# Altium schematic sheet External Connections.SchDoc
size A
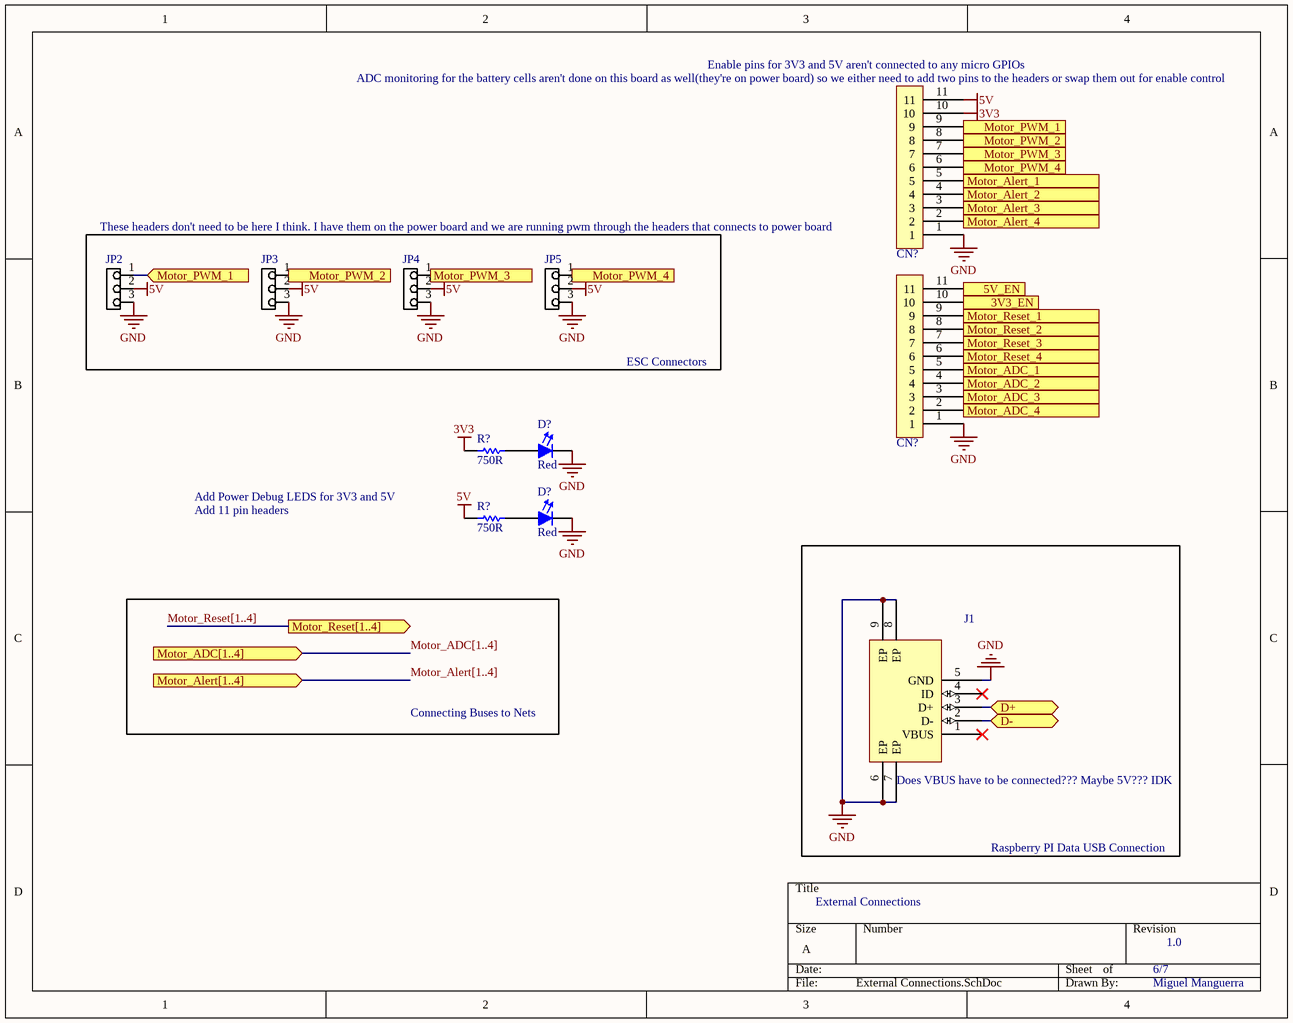
[diagram p0: External Connections.SchDoc]

## Parts
(Parts that share a designator on the sheet are numbered #1, #2 ... from top to bottom, then left to right.)
CN?#1  PH1-11-UA  [PH1-11-UA-Footprint-1]  (value not drawn)
CN?#2  PH1-11-UA  [PH1-11-UA-Footprint-1]  (value not drawn)
D?#1  Color: Red  [FP-LB_Q39E-MFG]  (hidden comment: LSQ976-NR-1)
D?#2  Color: Red  [FP-LB_Q39E-MFG]  (hidden comment: LSQ976-NR-1)
J1  USB - Micro B Female SMD  [Edge Connector]  (value not drawn)
JP2  1x3 Male Jumper  [Header, Male, 1x3, Pitch: 0.1" (2.54mm),THT]  (value not drawn)
JP3  1x3 Male Jumper  [Header, Male, 1x3, Pitch: 0.1" (2.54mm),THT]  (value not drawn)
JP4  1x3 Male Jumper  [Header, Male, 1x3, Pitch: 0.1" (2.54mm),THT]  (value not drawn)
JP5  1x3 Male Jumper  [Header, Male, 1x3, Pitch: 0.1" (2.54mm),THT]  (value not drawn)
R?#1  Resistance: 750R  [RESC0603(1608)_N]  (hidden comment: RC0603FR-07750RL)
R?#2  Resistance: 750R  [RESC0603(1608)_N]  (hidden comment: RC0603FR-07750RL)

## Blocks framed on the sheet
ESC Connectors: JP2-JP5

## Ports
3V3_EN (in), 5V_EN (in), D+ (bidir), D- (bidir), Motor_ADC[1..4] (in), Motor_ADC_1, Motor_ADC_2, Motor_ADC_3, Motor_ADC_4, Motor_Alert[1..4] (in), Motor_Alert_1 (out), Motor_Alert_2 (out), Motor_Alert_3 (out), Motor_Alert_4 (out), Motor_PWM_1 (in), Motor_PWM_2 (in), Motor_PWM_3 (in), Motor_PWM_4 (in), Motor_Reset[1..4] (out), Motor_Reset_1, Motor_Reset_2, Motor_Reset_3, Motor_Reset_4

## Nets
3V3: CN?#1.10 R?#1.2
5V: CN?#1.11 JP2.2 JP3.2 JP4.2 JP5.2 R?#2.2
GND: CN?#1.1 CN?#2.1 D?#1.1(Cathode) D?#2.1(Cathode) J1.5(GND) J1.6(EP) J1.7(EP) J1.8(EP) J1.9(EP) JP2.3 JP3.3 JP4.3 JP5.3
3V3_EN: CN?#2.10 ; port 3V3_EN
5V_EN: CN?#2.11 ; port 5V_EN
D+: J1.3(D+) ; port D+
D-: J1.2(D-) ; port D-
Motor_ADC_1: CN?#2.5 ; port Motor_ADC_1
Motor_ADC_2: CN?#2.4 ; port Motor_ADC_2
Motor_ADC_3: CN?#2.3 ; port Motor_ADC_3
Motor_ADC_4: CN?#2.2 ; port Motor_ADC_4
Motor_Alert_1: CN?#1.5 ; port Motor_Alert_1
Motor_Alert_2: CN?#1.4 ; port Motor_Alert_2
Motor_Alert_3: CN?#1.3 ; port Motor_Alert_3
Motor_Alert_4: CN?#1.2 ; port Motor_Alert_4
Motor_PWM_1: CN?#1.9 JP2.1 ; port Motor_PWM_1
Motor_PWM_2: CN?#1.8 JP3.1 ; port Motor_PWM_2
Motor_PWM_3: CN?#1.7 JP4.1 ; port Motor_PWM_3
Motor_PWM_4: CN?#1.6 JP5.1 ; port Motor_PWM_4
Motor_Reset_1: CN?#2.9 ; port Motor_Reset_1
Motor_Reset_2: CN?#2.8 ; port Motor_Reset_2
Motor_Reset_3: CN?#2.7 ; port Motor_Reset_3
Motor_Reset_4: CN?#2.6 ; port Motor_Reset_4
NetD?#1_2: D?#1.2(Anode) R?#1.1
NetD?#2_2: D?#2.2(Anode) R?#2.1

Not connected (* = marked no-connect by the designer): J1 1(VBUS)* 4(ID)*

## Buses and harness runs
bus Motor_ADC[1..4] = port Motor_ADC[1..4]
bus Motor_Alert[1..4] = port Motor_Alert[1..4]
bus Motor_Reset[1..4] = port Motor_Reset[1..4]

## Notes on the sheet
- (near CN?#1) ADC monitoring for the battery cells aren't done on this board as well(they're on power board) so we either need to add two pins to the headers or swap them out for enable control
- (near CN?#1) Enable pins for 3V3 and 5V aren't connected to any micro GPIOs
- (near CN?#1) These headers don't need to be here I think. I have them on the power board and we are running pwm through the headers that connects to power board
- Add Power Debug LEDS for 3V3 and 5V
- Add 11 pin headers
- Connecting Buses to Nets
- (near J1) Does VBUS have to be connected??? Maybe 5V??? IDK
- External Connections
- Raspberry PI Data USB Connection
- 6/7
- 1.0
- Miguel Manguerra

## Library data of the parts
CN?#1 CN?#2 = CMP-00135-1: Connector Header Through Hole 11 position 0.100" (2.54mm)
D?#1 D?#2 = CMP-00066-2: LED Red 645nm 2-Pin Chip 0603(1608Metric) T/R; Lens Transparency: Diffused; Power Dissipation: 65mW; Forward Voltage: 2.5V; Dominant Wavelength: 633nm; Number of Elements: 1; Lens Style: Diffused,Flat,Colorless,Rectangular; Lens Color: White; Viewing Angle: 160°; Luminous Flux: 0.33lm; Test Current: 20mA; Forward Current: 25mA; Luminous Intensity: 180mcd; Reverse Voltage: 12V; Lens Size: 0.8mm; Max Operating Temperature: 85°C; Depth: 0.9mm; Illumination Color: Red; Packaging: Tape and Reel; Min Operating Temperature: -30°C; Case Code (Imperial): 0603; Case Code (Metric): 1608; Number of Pins: 2; Mount: Surface Mount; Height: 0.8mm; Package Quantity: 1; Length: 1.7mm; Width: 0.8mm; Number of LEDs: 1; Case/Package: 0603; Radiation Hardening: No
J1 = CMP-00108-2: USB - Micro B Female USB 2 5 SMD USB Connectors; Created by: Miguel Manguerra; LCSC Part Number: C319170
JP2-JP5 = CMP-004-0002-1: Made By: Poorna Chander Kalidas; Component Type: Standard; Design Item ID: 1x3 Male Jumper; Source: AUVic_Schematic_Library_Connectors.SchLib; Pin Count: 3
R?#1 R?#2 = CMP-00070-1: Res Thick Film 0603 750 Ohm 1% 0.1W(1/10W) ±100ppm/C Epoxy SMD T/R; Voltage Rating (DC): 50V; Power Rating: 100mW; Temperature Coefficient: 100ppm/°C; Height: 0.022inch; Tolerance: 1%; Voltage Rating: 50V; Case Code (Metric): 1608; Packaging: Tape and Reel; Depth: 0.8mm; Package Quantity: 1; Termination: SMD/SMT; Number of Terminations: 2; Min Operating Temperature: -55°C; Case/Package: 0603; Composition: Thick Film; Width: 0.031inch; Max Operating Temperature: 155°C; Max Power Dissipation: 100mW; Length: 1.6mm; Military Standard: Not; Features: Moisture Resistant; Case Code (Imperial): 0603; Lead Free: Lead Free